# Altium schematic sheet Power.SchDoc
size 420 x 297 mm; SheetNumber: 1; SheetTotal: 1
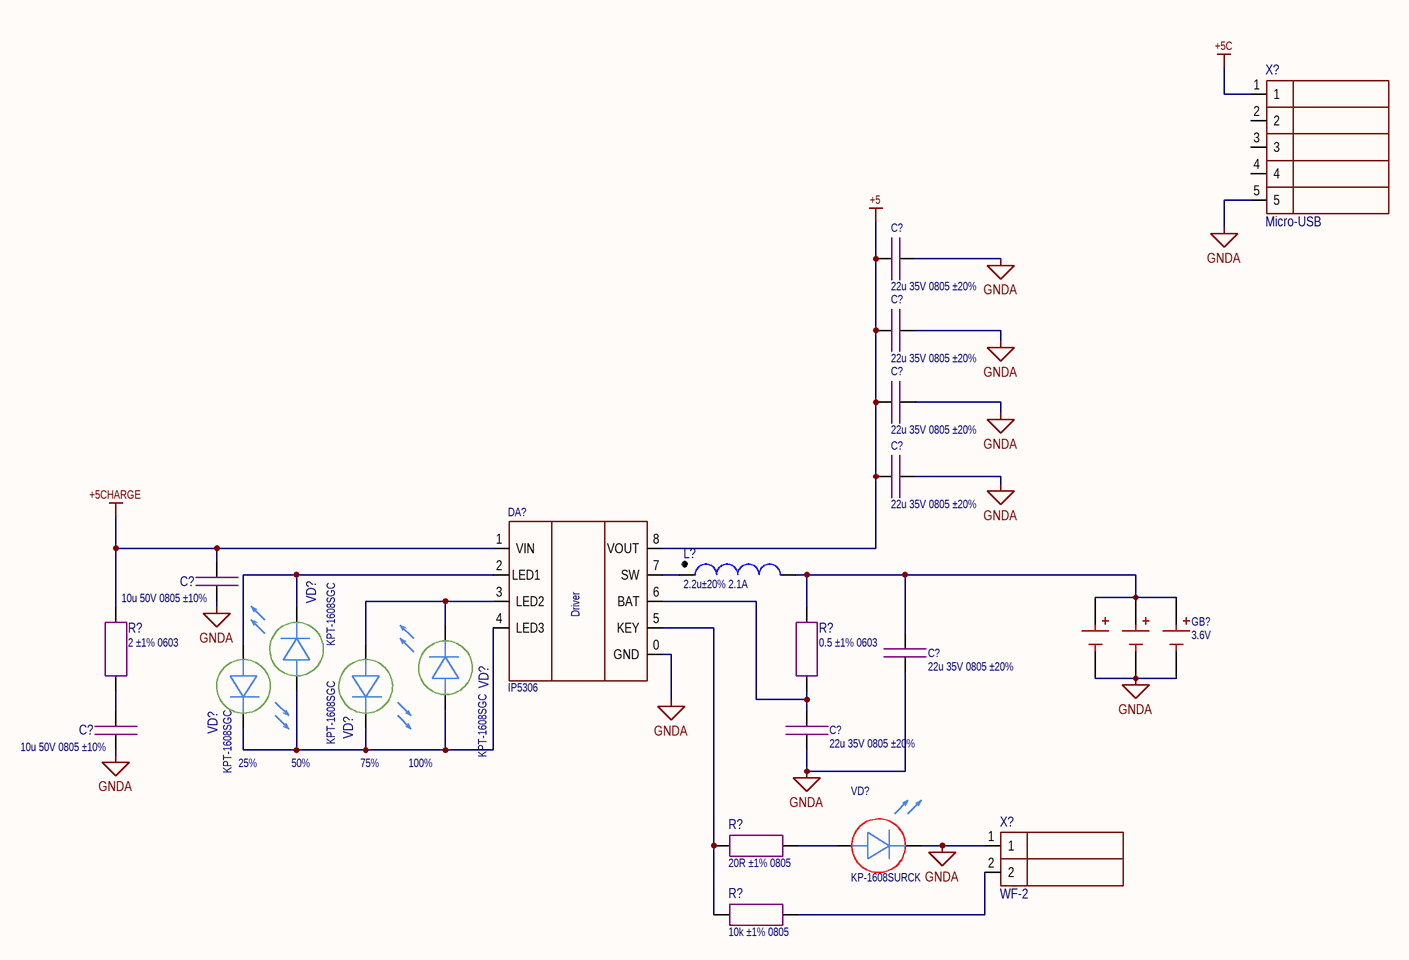
[diagram p0: Power.SchDoc]

## Parts
(Parts that share a designator on the sheet are numbered #1, #2 ... from top to bottom, then left to right.)
C?#1  22u 35V 0805 ±20%  [CAP: SMD 0805 MD IPC 782]
C?#2  22u 35V 0805 ±20%  [CAP: SMD 0805 MD IPC 782]
C?#3  22u 35V 0805 ±20%  [CAP: SMD 0805 MD IPC 782]
C?#4  22u 35V 0805 ±20%  [CAP: SMD 0805 MD IPC 782]
C?#5  10u 50V 0805 ±10%  [CAP: SMD 0805 MD IPC 782]
C?#6  22u 35V 0805 ±20%  [CAP: SMD 0805 MD IPC 782]
C?#7  10u 50V 0805 ±10%  [CAP: SMD 0805 MD IPC 782]
C?#8  22u 35V 0805 ±20%  [CAP: SMD 0805 MD IPC 782]
DA?  IP5306  [IC: SOIC 8 TP]
GB?  3.6V  [18650х3]
L?  2.2u±20% 2.1A  [IND: LPS3015]
R?#1  2 ±1% 0603  [RES: SMD 0603 MD IPC 782]
R?#2  0.5 ±1% 0603  [RES: SMD 0603 MD IPC 782]
R?#3  20R ±1% 0805  [RES: SMD 0805 MD IPC 782]
R?#4  10k ±1% 0805  [RES: SMD 0805 MD IPC 782]
VD?#1  KPT-1608SGC  [DIODE: LED 0603(1608) green]
VD?#2  KPT-1608SGC  [DIODE: LED 0603(1608) green]
VD?#3  KPT-1608SGC  [DIODE: LED 0603(1608) green]
VD?#4  KPT-1608SGC  [DIODE: LED 0603(1608) green]
VD?#5  KP-1608SURCK  [DIODE: LED 0603(1608) red]
X?#1  Micro-USB  [CON: 5pin USB Micro]
X?#2  WF-2  [CON: 2pin wf-2]

## Nets
+5: C?#1.1 C?#2.1 C?#3.1 C?#4.1 DA?.8(VOUT)
+5C: X?#1.1
+5CHARGE: C?#5.1 DA?.1(VIN) R?#1.2
GNDA: C?#1.2 C?#2.2 C?#3.2 C?#4.2 C?#5.2 C?#6.2 C?#7.2 C?#8.2 DA?.0(GND) GB?.1- GB?.2- GB?.3- VD?#5.1 X?#1.5 X?#2.1
NetC?#6_1: C?#6.1 GB?.1+ GB?.2+ GB?.3+ L?.2 R?#2.2
NetC?#7_1: C?#7.1 R?#1.1
NetC?#8_1: C?#8.1 DA?.6(BAT) R?#2.1
NetDA?_2: DA?.2(LED1) VD?#1.2 VD?#3.1
NetDA?_3: DA?.3(LED2) VD?#2.2 VD?#4.1
NetDA?_4: DA?.4(LED3) VD?#1.1 VD?#2.1 VD?#3.2 VD?#4.2
NetDA?_5: DA?.5(KEY) R?#3.1 R?#4.1
NetDA?_7: DA?.7(SW) L?.1
NetR?#3_2: R?#3.2 VD?#5.2
NetR?#4_2: R?#4.2 X?#2.2

Not connected (* = marked no-connect by the designer): X?#1 2 3 4

## Notes on the sheet
- (near VD?#1) 25%
- 50%
- (near VD?#2) 75%
- 100%
- Перв. примен.
- 3707.00000000 ЭИТ-1
- Справ. №
- Подп. и дата
- Инв. № дубл.
- Взам. инв. №
- Разраб.
- Изм.
- Лист
- № докум.
- Подп.
- Дата
- Лит.
- Масса
- Масштаб
- Пров.
- Т.контр.
- Листов
- Инв. № подл.
- Утв.
- Н.контр.
- 2.106-A3
- Копировал
- Формат А3
- (in symbol IP5306) Driver

## Library data of the parts
C?#1-C?#4 C?#6 C?#8 = 22u 35V 0805 ±20%: Code: 6279375691; Name: Конденсатор X5R 35V 22uF±20% 0805
C?#5 C?#7 = 10u 50V 0805 ±10%: Code: 6289735441; Name: Конденсатор 12065D106KAT2A, AVX
GB? = 18650 х 3
L? = 2.2u±20% 2.1A: LPS3015; Code: 6319247691; Name: Дроссель LPS3015-222MRC, Coilcraft
R?#1 = 2 ±1% 0603: Code: 6069180891; Name: Резистор 2,2k ±1% 0603
R?#2 = 0.5 ±1% 0603: Name: Резистор 0.5 ±1% 0603
R?#3 = 20R ±1% 0805: Code: 6094357581; Name: 20R ±1% 0805
R?#4 = 10k ±1% 0805: Code: 6020003061; Name: Резистор RC0805JR-0710KL
VD?#1-VD?#4 = LED green 0603: Code: 6340003921; Name: Светодиод KPT-1608SGC, Kingbright
VD?#5 = LED red 0603: Code: 6349551609; Name: Светодиод KP-1608SURCK
X?#1 = 5 pin USB Micro SMD: Code: 6319209171; Name: Розетка 10118194-0001LF, Amphenol
X?#2 = 2 pin WF-2: Code: 6313952902; Name: Вилка WF-2